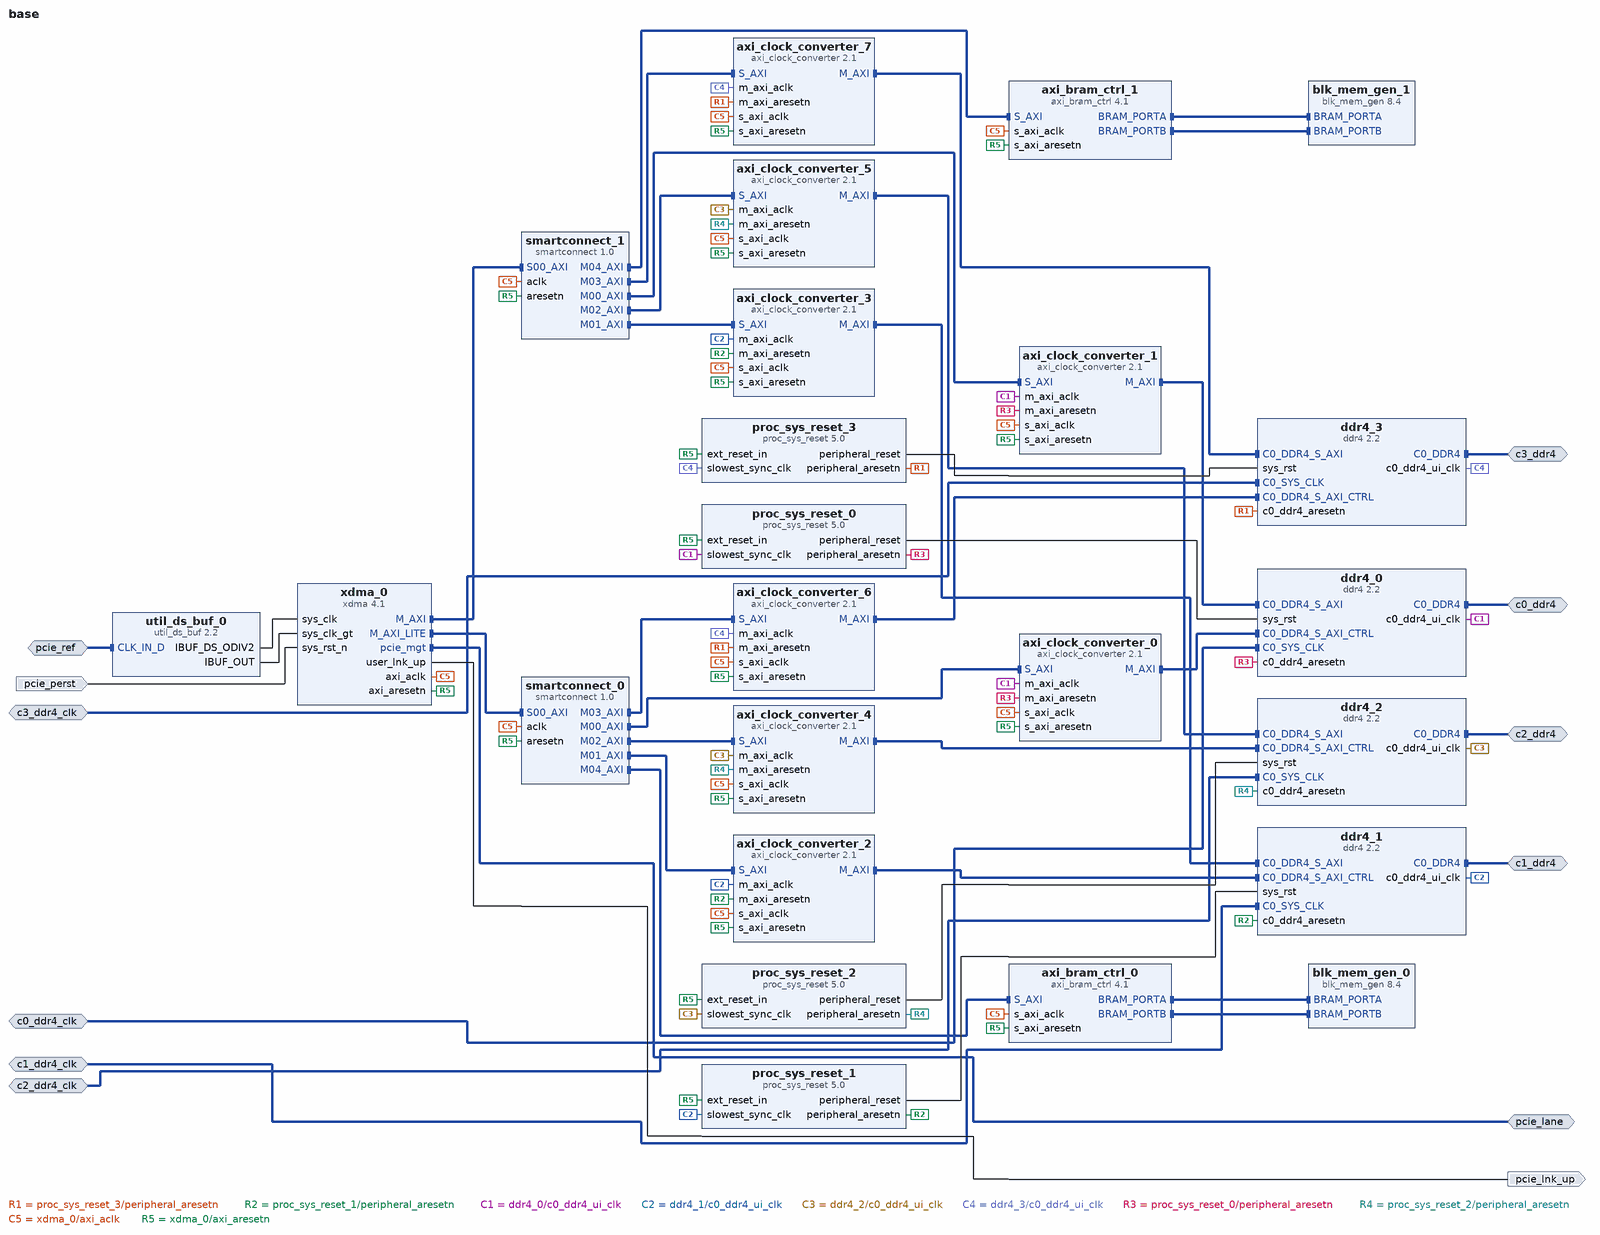
[diagram p0: block diagram of the top level]
# Vivado block design base, xcvu13p-fhgb2104-2-i, Vivado 2022.2
create_bd_design base

create_bd_intf_port -mode Master -vlnv xilinx.com:interface:ddr4_rtl:1.0 c0_ddr4
create_bd_intf_port -mode Slave -vlnv xilinx.com:interface:diff_clock_rtl:1.0 c0_ddr4_clk
set_property -dict {CONFIG.FREQ_HZ 400000000} [get_bd_intf_ports c0_ddr4_clk]
create_bd_intf_port -mode Master -vlnv xilinx.com:interface:ddr4_rtl:1.0 c1_ddr4
create_bd_intf_port -mode Slave -vlnv xilinx.com:interface:diff_clock_rtl:1.0 c1_ddr4_clk
set_property -dict {CONFIG.FREQ_HZ 400000000} [get_bd_intf_ports c1_ddr4_clk]
create_bd_intf_port -mode Master -vlnv xilinx.com:interface:ddr4_rtl:1.0 c2_ddr4
create_bd_intf_port -mode Slave -vlnv xilinx.com:interface:diff_clock_rtl:1.0 c2_ddr4_clk
set_property -dict {CONFIG.FREQ_HZ 400000000} [get_bd_intf_ports c2_ddr4_clk]
create_bd_intf_port -mode Master -vlnv xilinx.com:interface:ddr4_rtl:1.0 c3_ddr4
create_bd_intf_port -mode Slave -vlnv xilinx.com:interface:diff_clock_rtl:1.0 c3_ddr4_clk
set_property -dict {CONFIG.FREQ_HZ 400000000} [get_bd_intf_ports c3_ddr4_clk]
create_bd_intf_port -mode Slave -vlnv xilinx.com:interface:diff_clock_rtl:1.0 pcie_ref
create_bd_intf_port -mode Master -vlnv xilinx.com:interface:pcie_7x_mgt_rtl:1.0 pcie_lane
create_bd_port -dir I -type rst pcie_perst
create_bd_port -dir O pcie_lnk_up

create_bd_cell -type ip -vlnv xilinx.com:ip:xdma:4.1 xdma_0
set_property -dict [list \
  CONFIG.axilite_master_en true \
  CONFIG.cfg_mgmt_if false \
  CONFIG.mcap_enablement Tandem_PCIe \
  CONFIG.mcap_fpga_bitstream_version 00000000 \
  CONFIG.mode_selection Advanced \
  CONFIG.pcie_extended_tag false \
  CONFIG.pl_link_cap_max_link_speed 8.0_GT/s \
  CONFIG.pl_link_cap_max_link_width X16 \
  CONFIG.xdma_num_usr_irq 8 \
  CONFIG.xdma_rnum_chnl 4 \
  CONFIG.xdma_wnum_chnl 4 \
] [get_bd_cells xdma_0]
create_bd_cell -type ip -vlnv xilinx.com:ip:ddr4:2.2 ddr4_0
set_property -dict [list \
  CONFIG.C0.DDR4_CasLatency 16 \
  CONFIG.C0.DDR4_DataWidth 72 \
  CONFIG.C0.DDR4_InputClockPeriod 2499 \
  CONFIG.C0.DDR4_MemoryPart MT40A512M16HA-083E \
  CONFIG.C0.DDR4_TimePeriod 833 \
] [get_bd_cells ddr4_0]
create_bd_cell -type ip -vlnv xilinx.com:ip:smartconnect:1.0 smartconnect_0
set_property -dict {CONFIG.NUM_MI 5 CONFIG.NUM_SI 1} [get_bd_cells smartconnect_0]
create_bd_cell -type ip -vlnv xilinx.com:ip:axi_clock_converter:2.1 axi_clock_converter_0
create_bd_cell -type ip -vlnv xilinx.com:ip:proc_sys_reset:5.0 proc_sys_reset_0
create_bd_cell -type ip -vlnv xilinx.com:ip:axi_bram_ctrl:4.1 axi_bram_ctrl_0
create_bd_cell -type ip -vlnv xilinx.com:ip:blk_mem_gen:8.4 blk_mem_gen_0
set_property -dict {CONFIG.Memory_Type True_Dual_Port_RAM} [get_bd_cells blk_mem_gen_0]
create_bd_cell -type ip -vlnv xilinx.com:ip:axi_clock_converter:2.1 axi_clock_converter_1
create_bd_cell -type ip -vlnv xilinx.com:ip:axi_clock_converter:2.1 axi_clock_converter_2
create_bd_cell -type ip -vlnv xilinx.com:ip:axi_clock_converter:2.1 axi_clock_converter_3
create_bd_cell -type ip -vlnv xilinx.com:ip:axi_clock_converter:2.1 axi_clock_converter_4
create_bd_cell -type ip -vlnv xilinx.com:ip:axi_clock_converter:2.1 axi_clock_converter_5
create_bd_cell -type ip -vlnv xilinx.com:ip:axi_clock_converter:2.1 axi_clock_converter_6
create_bd_cell -type ip -vlnv xilinx.com:ip:axi_clock_converter:2.1 axi_clock_converter_7
create_bd_cell -type ip -vlnv xilinx.com:ip:ddr4:2.2 ddr4_1
set_property -dict [list \
  CONFIG.C0.DDR4_CasLatency 16 \
  CONFIG.C0.DDR4_DataWidth 72 \
  CONFIG.C0.DDR4_InputClockPeriod 2499 \
  CONFIG.C0.DDR4_MemoryPart MT40A512M16HA-083E \
  CONFIG.C0.DDR4_TimePeriod 833 \
] [get_bd_cells ddr4_1]
create_bd_cell -type ip -vlnv xilinx.com:ip:ddr4:2.2 ddr4_2
set_property -dict [list \
  CONFIG.C0.DDR4_CasLatency 16 \
  CONFIG.C0.DDR4_DataWidth 72 \
  CONFIG.C0.DDR4_InputClockPeriod 2499 \
  CONFIG.C0.DDR4_MemoryPart MT40A512M16HA-083E \
  CONFIG.C0.DDR4_TimePeriod 833 \
] [get_bd_cells ddr4_2]
create_bd_cell -type ip -vlnv xilinx.com:ip:ddr4:2.2 ddr4_3
set_property -dict [list \
  CONFIG.C0.DDR4_CasLatency 16 \
  CONFIG.C0.DDR4_DataWidth 72 \
  CONFIG.C0.DDR4_InputClockPeriod 2499 \
  CONFIG.C0.DDR4_MemoryPart MT40A512M16HA-083E \
  CONFIG.C0.DDR4_TimePeriod 833 \
] [get_bd_cells ddr4_3]
create_bd_cell -type ip -vlnv xilinx.com:ip:proc_sys_reset:5.0 proc_sys_reset_1
create_bd_cell -type ip -vlnv xilinx.com:ip:proc_sys_reset:5.0 proc_sys_reset_2
create_bd_cell -type ip -vlnv xilinx.com:ip:proc_sys_reset:5.0 proc_sys_reset_3
create_bd_cell -type ip -vlnv xilinx.com:ip:axi_bram_ctrl:4.1 axi_bram_ctrl_1
set_property -dict {CONFIG.DATA_WIDTH 512} [get_bd_cells axi_bram_ctrl_1]
create_bd_cell -type ip -vlnv xilinx.com:ip:blk_mem_gen:8.4 blk_mem_gen_1
set_property -dict {CONFIG.Memory_Type True_Dual_Port_RAM} [get_bd_cells blk_mem_gen_1]
create_bd_cell -type ip -vlnv xilinx.com:ip:smartconnect:1.0 smartconnect_1
set_property -dict {CONFIG.NUM_MI 5 CONFIG.NUM_SI 1} [get_bd_cells smartconnect_1]
create_bd_cell -type ip -vlnv xilinx.com:ip:util_ds_buf:2.2 util_ds_buf_0
set_property -dict {CONFIG.C_BUF_TYPE IBUFDSGTE} [get_bd_cells util_ds_buf_0]

# ---- connections ----

connect_bd_intf_net [get_bd_intf_pins axi_bram_ctrl_0/BRAM_PORTA] [get_bd_intf_pins blk_mem_gen_0/BRAM_PORTA]
connect_bd_intf_net [get_bd_intf_pins axi_bram_ctrl_0/BRAM_PORTB] [get_bd_intf_pins blk_mem_gen_0/BRAM_PORTB]
connect_bd_intf_net [get_bd_intf_pins axi_bram_ctrl_1/BRAM_PORTA] [get_bd_intf_pins blk_mem_gen_1/BRAM_PORTA]
connect_bd_intf_net [get_bd_intf_pins blk_mem_gen_1/BRAM_PORTB] [get_bd_intf_pins axi_bram_ctrl_1/BRAM_PORTB]
connect_bd_intf_net [get_bd_intf_pins ddr4_0/C0_DDR4_S_AXI_CTRL] [get_bd_intf_pins axi_clock_converter_0/M_AXI]
connect_bd_intf_net [get_bd_intf_pins axi_clock_converter_1/M_AXI] [get_bd_intf_pins ddr4_0/C0_DDR4_S_AXI]
connect_bd_intf_net [get_bd_intf_pins axi_clock_converter_2/M_AXI] [get_bd_intf_pins ddr4_1/C0_DDR4_S_AXI_CTRL]
connect_bd_intf_net [get_bd_intf_pins axi_clock_converter_3/M_AXI] [get_bd_intf_pins ddr4_1/C0_DDR4_S_AXI]
connect_bd_intf_net [get_bd_intf_pins axi_clock_converter_4/M_AXI] [get_bd_intf_pins ddr4_2/C0_DDR4_S_AXI_CTRL]
connect_bd_intf_net [get_bd_intf_pins axi_clock_converter_5/M_AXI] [get_bd_intf_pins ddr4_2/C0_DDR4_S_AXI]
connect_bd_intf_net [get_bd_intf_pins axi_clock_converter_6/M_AXI] [get_bd_intf_pins ddr4_3/C0_DDR4_S_AXI_CTRL]
connect_bd_intf_net [get_bd_intf_pins axi_clock_converter_7/M_AXI] [get_bd_intf_pins ddr4_3/C0_DDR4_S_AXI]
connect_bd_intf_net [get_bd_intf_ports c0_ddr4] [get_bd_intf_pins ddr4_0/C0_DDR4]
connect_bd_intf_net [get_bd_intf_ports c1_ddr4] [get_bd_intf_pins ddr4_1/C0_DDR4]
connect_bd_intf_net [get_bd_intf_ports c2_ddr4] [get_bd_intf_pins ddr4_2/C0_DDR4]
connect_bd_intf_net [get_bd_intf_ports c3_ddr4] [get_bd_intf_pins ddr4_3/C0_DDR4]
connect_bd_intf_net -intf_net diff_clock_rtl_0_1 [get_bd_intf_ports c0_ddr4_clk] [get_bd_intf_pins ddr4_0/C0_SYS_CLK]
connect_bd_intf_net -intf_net diff_clock_rtl_1_1 [get_bd_intf_ports c1_ddr4_clk] [get_bd_intf_pins ddr4_1/C0_SYS_CLK]
connect_bd_intf_net -intf_net diff_clock_rtl_2_1 [get_bd_intf_ports c2_ddr4_clk] [get_bd_intf_pins ddr4_2/C0_SYS_CLK]
connect_bd_intf_net -intf_net diff_clock_rtl_3_1 [get_bd_intf_ports c3_ddr4_clk] [get_bd_intf_pins ddr4_3/C0_SYS_CLK]
connect_bd_intf_net [get_bd_intf_ports pcie_ref] [get_bd_intf_pins util_ds_buf_0/CLK_IN_D]
connect_bd_intf_net [get_bd_intf_pins smartconnect_0/M00_AXI] [get_bd_intf_pins axi_clock_converter_0/S_AXI]
connect_bd_intf_net [get_bd_intf_pins smartconnect_0/M01_AXI] [get_bd_intf_pins axi_clock_converter_2/S_AXI]
connect_bd_intf_net [get_bd_intf_pins smartconnect_0/M02_AXI] [get_bd_intf_pins axi_clock_converter_4/S_AXI]
connect_bd_intf_net [get_bd_intf_pins smartconnect_0/M03_AXI] [get_bd_intf_pins axi_clock_converter_6/S_AXI]
connect_bd_intf_net [get_bd_intf_pins smartconnect_0/M04_AXI] [get_bd_intf_pins axi_bram_ctrl_0/S_AXI]
connect_bd_intf_net [get_bd_intf_pins smartconnect_1/M00_AXI] [get_bd_intf_pins axi_clock_converter_1/S_AXI]
connect_bd_intf_net [get_bd_intf_pins smartconnect_1/M01_AXI] [get_bd_intf_pins axi_clock_converter_3/S_AXI]
connect_bd_intf_net [get_bd_intf_pins smartconnect_1/M02_AXI] [get_bd_intf_pins axi_clock_converter_5/S_AXI]
connect_bd_intf_net [get_bd_intf_pins smartconnect_1/M03_AXI] [get_bd_intf_pins axi_clock_converter_7/S_AXI]
connect_bd_intf_net [get_bd_intf_pins smartconnect_1/M04_AXI] [get_bd_intf_pins axi_bram_ctrl_1/S_AXI]
connect_bd_intf_net [get_bd_intf_pins xdma_0/M_AXI] [get_bd_intf_pins smartconnect_1/S00_AXI]
connect_bd_intf_net [get_bd_intf_pins xdma_0/M_AXI_LITE] [get_bd_intf_pins smartconnect_0/S00_AXI]
connect_bd_intf_net [get_bd_intf_ports pcie_lane] [get_bd_intf_pins xdma_0/pcie_mgt]
connect_bd_net [get_bd_pins proc_sys_reset_3/peripheral_aresetn] \
  [get_bd_pins axi_clock_converter_6/m_axi_aresetn] [get_bd_pins axi_clock_converter_7/m_axi_aresetn] \
  [get_bd_pins ddr4_3/c0_ddr4_aresetn]
connect_bd_net [get_bd_pins proc_sys_reset_1/peripheral_aresetn] \
  [get_bd_pins axi_clock_converter_2/m_axi_aresetn] [get_bd_pins axi_clock_converter_3/m_axi_aresetn] \
  [get_bd_pins ddr4_1/c0_ddr4_aresetn]
connect_bd_net [get_bd_pins ddr4_0/c0_ddr4_ui_clk] \
  [get_bd_pins proc_sys_reset_0/slowest_sync_clk] [get_bd_pins axi_clock_converter_1/m_axi_aclk] \
  [get_bd_pins axi_clock_converter_0/m_axi_aclk]
connect_bd_net [get_bd_pins ddr4_1/c0_ddr4_ui_clk] \
  [get_bd_pins proc_sys_reset_1/slowest_sync_clk] [get_bd_pins axi_clock_converter_3/m_axi_aclk] \
  [get_bd_pins axi_clock_converter_2/m_axi_aclk]
connect_bd_net [get_bd_pins ddr4_2/c0_ddr4_ui_clk] \
  [get_bd_pins proc_sys_reset_2/slowest_sync_clk] [get_bd_pins axi_clock_converter_5/m_axi_aclk] \
  [get_bd_pins axi_clock_converter_4/m_axi_aclk]
connect_bd_net [get_bd_pins ddr4_3/c0_ddr4_ui_clk] \
  [get_bd_pins proc_sys_reset_3/slowest_sync_clk] [get_bd_pins axi_clock_converter_7/m_axi_aclk] \
  [get_bd_pins axi_clock_converter_6/m_axi_aclk]
connect_bd_net [get_bd_ports pcie_perst] [get_bd_pins xdma_0/sys_rst_n]
connect_bd_net [get_bd_pins proc_sys_reset_0/peripheral_aresetn] \
  [get_bd_pins ddr4_0/c0_ddr4_aresetn] [get_bd_pins axi_clock_converter_1/m_axi_aresetn] \
  [get_bd_pins axi_clock_converter_0/m_axi_aresetn]
connect_bd_net [get_bd_pins proc_sys_reset_0/peripheral_reset] [get_bd_pins ddr4_0/sys_rst]
connect_bd_net [get_bd_pins proc_sys_reset_1/peripheral_reset] [get_bd_pins ddr4_1/sys_rst]
connect_bd_net [get_bd_pins proc_sys_reset_2/peripheral_aresetn] \
  [get_bd_pins ddr4_2/c0_ddr4_aresetn] [get_bd_pins axi_clock_converter_5/m_axi_aresetn] \
  [get_bd_pins axi_clock_converter_4/m_axi_aresetn]
connect_bd_net [get_bd_pins proc_sys_reset_2/peripheral_reset] [get_bd_pins ddr4_2/sys_rst]
connect_bd_net [get_bd_pins proc_sys_reset_3/peripheral_reset] [get_bd_pins ddr4_3/sys_rst]
connect_bd_net [get_bd_pins util_ds_buf_0/IBUF_DS_ODIV2] [get_bd_pins xdma_0/sys_clk]
connect_bd_net [get_bd_pins util_ds_buf_0/IBUF_OUT] [get_bd_pins xdma_0/sys_clk_gt]
connect_bd_net [get_bd_pins xdma_0/axi_aclk] \
  [get_bd_pins smartconnect_1/aclk] [get_bd_pins smartconnect_0/aclk] [get_bd_pins axi_bram_ctrl_0/s_axi_aclk] \
  [get_bd_pins axi_bram_ctrl_1/s_axi_aclk] [get_bd_pins axi_clock_converter_0/s_axi_aclk] \
  [get_bd_pins axi_clock_converter_1/s_axi_aclk] [get_bd_pins axi_clock_converter_2/s_axi_aclk] \
  [get_bd_pins axi_clock_converter_3/s_axi_aclk] [get_bd_pins axi_clock_converter_4/s_axi_aclk] \
  [get_bd_pins axi_clock_converter_5/s_axi_aclk] [get_bd_pins axi_clock_converter_6/s_axi_aclk] \
  [get_bd_pins axi_clock_converter_7/s_axi_aclk]
connect_bd_net [get_bd_pins xdma_0/axi_aresetn] \
  [get_bd_pins smartconnect_1/aresetn] [get_bd_pins smartconnect_0/aresetn] [get_bd_pins axi_bram_ctrl_0/s_axi_aresetn] \
  [get_bd_pins axi_bram_ctrl_1/s_axi_aresetn] [get_bd_pins axi_clock_converter_0/s_axi_aresetn] \
  [get_bd_pins axi_clock_converter_1/s_axi_aresetn] [get_bd_pins axi_clock_converter_2/s_axi_aresetn] \
  [get_bd_pins axi_clock_converter_3/s_axi_aresetn] [get_bd_pins axi_clock_converter_4/s_axi_aresetn] \
  [get_bd_pins axi_clock_converter_5/s_axi_aresetn] [get_bd_pins axi_clock_converter_6/s_axi_aresetn] \
  [get_bd_pins axi_clock_converter_7/s_axi_aresetn] [get_bd_pins proc_sys_reset_0/ext_reset_in] \
  [get_bd_pins proc_sys_reset_1/ext_reset_in] [get_bd_pins proc_sys_reset_2/ext_reset_in] \
  [get_bd_pins proc_sys_reset_3/ext_reset_in]
connect_bd_net [get_bd_pins xdma_0/user_lnk_up] [get_bd_ports pcie_lnk_up]

# ---- address map ----
assign_bd_address -offset 0x00000000C0000000 -range 64K -target_address_space [get_bd_addr_spaces xdma_0/M_AXI] [get_bd_addr_segs axi_bram_ctrl_1/S_AXI/Mem0]
assign_bd_address -offset 0x0000000100000000 -range 4G -target_address_space [get_bd_addr_spaces xdma_0/M_AXI] [get_bd_addr_segs ddr4_0/C0_DDR4_MEMORY_MAP/C0_DDR4_ADDRESS_BLOCK]
assign_bd_address -offset 0x0000000200000000 -range 4G -target_address_space [get_bd_addr_spaces xdma_0/M_AXI] [get_bd_addr_segs ddr4_1/C0_DDR4_MEMORY_MAP/C0_DDR4_ADDRESS_BLOCK]
assign_bd_address -offset 0x0000000300000000 -range 4G -target_address_space [get_bd_addr_spaces xdma_0/M_AXI] [get_bd_addr_segs ddr4_2/C0_DDR4_MEMORY_MAP/C0_DDR4_ADDRESS_BLOCK]
assign_bd_address -offset 0x0000000400000000 -range 4G -target_address_space [get_bd_addr_spaces xdma_0/M_AXI] [get_bd_addr_segs ddr4_3/C0_DDR4_MEMORY_MAP/C0_DDR4_ADDRESS_BLOCK]
assign_bd_address -offset 0x80000000 -range 1M -target_address_space [get_bd_addr_spaces xdma_0/M_AXI_LITE] [get_bd_addr_segs ddr4_0/C0_DDR4_MEMORY_MAP_CTRL/C0_REG]
assign_bd_address -offset 0x80100000 -range 1M -target_address_space [get_bd_addr_spaces xdma_0/M_AXI_LITE] [get_bd_addr_segs ddr4_1/C0_DDR4_MEMORY_MAP_CTRL/C0_REG]
assign_bd_address -offset 0x80200000 -range 1M -target_address_space [get_bd_addr_spaces xdma_0/M_AXI_LITE] [get_bd_addr_segs ddr4_2/C0_DDR4_MEMORY_MAP_CTRL/C0_REG]
assign_bd_address -offset 0x80300000 -range 1M -target_address_space [get_bd_addr_spaces xdma_0/M_AXI_LITE] [get_bd_addr_segs ddr4_3/C0_DDR4_MEMORY_MAP_CTRL/C0_REG]
assign_bd_address -offset 0xC0000000 -range 8K -target_address_space [get_bd_addr_spaces xdma_0/M_AXI_LITE] [get_bd_addr_segs axi_bram_ctrl_0/S_AXI/Mem0]

validate_bd_design
save_bd_design
